# Altium schematic sheet vending-pad-002.SchDoc
size 381 x 350 mm; SheetNumber: 1; SheetTotal: 1
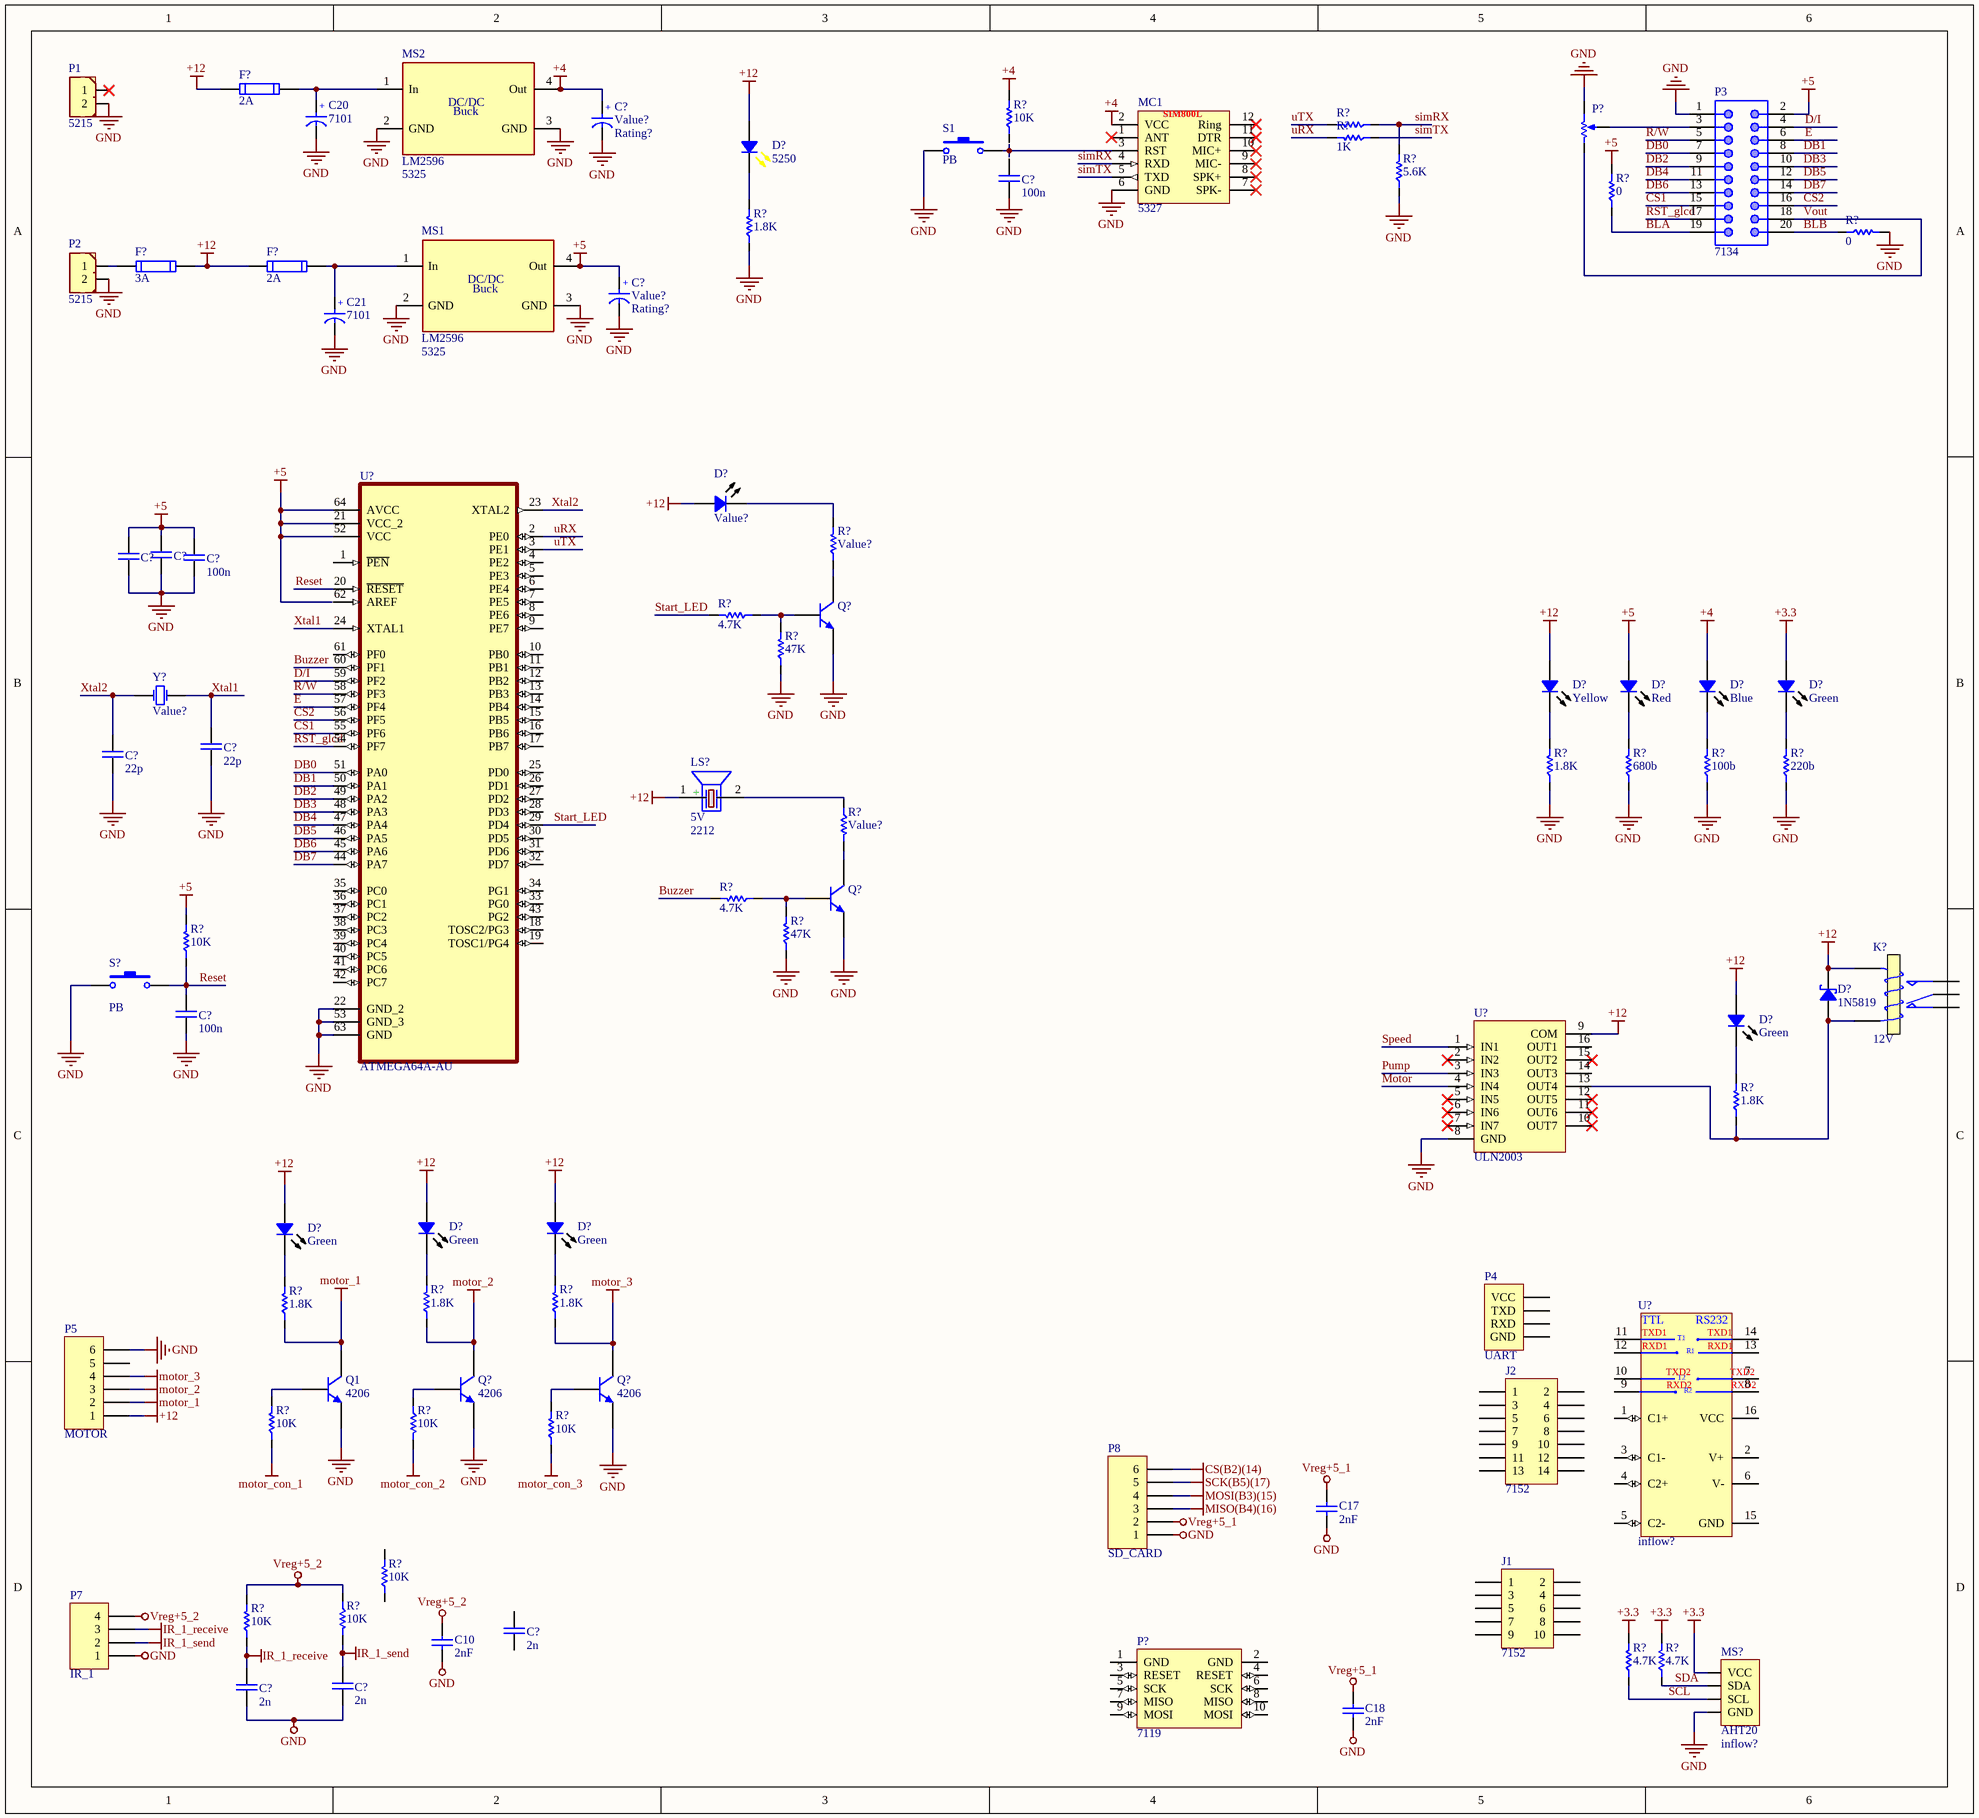
[diagram p0: vending-pad-002.SchDoc]

## Parts
(Parts that share a designator on the sheet are numbered #1, #2 ... from top to bottom, then left to right.)
C10  2nF  [CAP1206]
C17  2nF  [CAP1206]
C18  2nF  [CAP1206]
C20  Inflow: 7101  [Cap electrolitic radial 10x20-5]  (hidden comment: 2200u'F, 16'V)
C21  Inflow: 7101  [Cap electrolitic radial 10x20-5]  (hidden comment: 2200u'F, 16'V)
C?#1  Rating: Rating?  [SMT_C_Tantalum_A]  (hidden comment: Value?)
C?#2  100n  [CAP 1206/3216]
C?#3  Rating: Rating?  [SMT_C_Tantalum_A]  (hidden comment: Value?)
C?#4  (no value)  [CAP 1206/3216]
C?#5  (no value)  [CAP 1206/3216]
C?#6  100n  [CAP 1206/3216]
C?#7  22p  [CAP 1206/3216]
C?#8  22p  [CAP 1206/3216]
C?#9  100n  [CAP 1206/3216]
C?#10  2n  [CAP 1206/3216]
C?#11  2n  [CAP 1206/3216]
C?#12  2n  [CAP 1206/3216]
D?#1  Inflow: 5250  [LED 1206/3216 YELLOW]  (hidden comment: Yellow, 1206)
D?#2  Value?  [LED 1206/3216 GREEN]
D?#3  Yellow  [LED 0805/2012 YELLOW]
D?#4  Red  [LED 0805/2012 RED]
D?#5  Blue  [LED 0805/2012 BLUE]
D?#6  Green  [LED 0805/2012 GREEN]
D?#7  Green  [LED 0805/2012 GREEN]
D?#8  1N5819  [430X270D]
D?#9  Green  [LED 0805/2012 GREEN]
D?#10  Green  [LED 0805/2012 GREEN]
D?#11  Green  [LED 0805/2012 GREEN]
F?#1  2A  [1206_F]
F?#2  3A  [1206_F]
F?#3  2A  [1206_F]
J1  Inflow: 7152  [HDR_THT_5x2M_2.54mm]  (hidden comment: 5x2)
J2  Inflow: 7152  [HDR_THT_7x2M_2.54mm]  (hidden comment: 7x2)
K?  12V  [Relay 18.85x15.35x15.70]
LS?  Inflow: 2212  [BZ_SJ]  (hidden comment: 5V)
MC1  Inflow: 5327  [Sim800L_Module]  (hidden comment: Sim800L)
MS1  Inflow: 5325  [LM2596_modsen]  (hidden comment: LM2596)
MS2  Inflow: 5325  [LM2596_modsen]  (hidden comment: LM2596)
MS?  Inflow: inflow?  [AHT20]  (hidden comment: AHT20)
P1  Inflow: 5215  [645002117322]  (hidden comment: 2'Pin)
P2  Inflow: 5215  [645002117322]  (hidden comment: 2'Pin)
P3  Inflow: 7134  [BOX-HDR-10X2-2.54mm-S]  (hidden comment: 10x2)
P4  UART  [MOLEX KK 0022272041]
P5  MOTOR  [MO-Header 6]
P7  IR_1  [MO-Header 4]
P8  SD_CARD  [MO-Header 6]
P?#1  10K  [Multi turn 01]  (value not drawn)
P?#2  Inflow: 7119  [IDC2.54-10PIN]  (hidden comment: JTAG, 10'Pin)
Q1  Inflow: 4206  [TO-220 AB]  (hidden comment: NPN)
Q?#1  NPN  [SOT23_N]  (value not drawn)
Q?#2  NPN  [SOT23_N]  (value not drawn)
Q?#3  Inflow: 4206  [TO-220 AB]  (hidden comment: NPN)
Q?#4  Inflow: 4206  [TO-220 AB]  (hidden comment: NPN)
R?#1  47K  [RES 1206 (3216X08L)]  (value not drawn)
R?#2  10K  [RES 1206 (3216X08L)]
R?#3  1K  [RES 1206 (3216X08L)]
R?#4  5.6K  [RES 1206 (3216X08L)]
R?#5  0  [RES 1206 (3216X08L)]
R?#6  0  [RES 1206 (3216X08L)]
R?#7  1.8K  [RES 1206 (3216X08L)]
R?#8  Value?  [RES 1206 (3216X08L)]
R?#9  4.7K  [RES 1206 (3216X08L)]
R?#10  47K  [RES 1206 (3216X08L)]
R?#11  1.8K  [RES 0805 (2012X06L)]
R?#12  680b  [RES 0805 (2012X06L)]
R?#13  100b  [RES 0805 (2012X06L)]
R?#14  220b  [RES 0805 (2012X06L)]
R?#15  Value?  [RES 1206 (3216X08L)]
R?#16  4.7K  [RES 1206 (3216X08L)]
R?#17  47K  [RES 1206 (3216X08L)]
R?#18  10K  [RES 1206 (3216X08L)]
R?#19  1.8K  [RES 0805 (2012X06L)]
R?#20  1.8K  [RES 0805 (2012X06L)]
R?#21  1.8K  [RES 0805 (2012X06L)]
R?#22  1.8K  [RES 0805 (2012X06L)]
R?#23  10K  [RES 1206 (3216X08L)]
R?#24  10K  [RES 1206 (3216X08L)]
R?#25  10K  [RES 1206 (3216X08L)]
R?#26  10K  [RES 1206 (3216X08L)]
R?#27  10K  [RES 1206 (3216X08L)]
R?#28  10K  [RES 1206 (3216X08L)]
R?#29  4.7K  [RES 0805 (2012X06L)]
R?#30  4.7K  [RES 0805 (2012X06L)]
S1  PB  [SW_PB_SMD_2PIN_SPST_6X3X2]
S?  PB  [SW_PB_SMD_2PIN_SPST_6X3X2]
U?#1  ATMEGA64A-AU  [QFP80P1600X1600X120-64N]
U?#2  ULN2003  [SO16_M]
U?#3  Inflow: inflow?  [NSO16_M]  (hidden comment: MAX3232)
Y?  Value?  [XTAL Small]

## Nets
+3.3: D?#6.1 MS?.4(VCC) R?#29.2 R?#30.2
+4: C?#1.1(+) D?#5.1 MC1.2(VCC) MS2.4(Out)
+5: C?#3.1(+) C?#4.1 C?#5.1 C?#6.1 D?#4.1 MS1.4(Out) P3.2 R?#5.2 R?#18.2 U?#1.21(VCC_2) U?#1.52(VCC) U?#1.64(AVCC)
+12: D?#1.1 D?#2.1 D?#3.1 D?#7.1 D?#8.2 D?#9.1 D?#10.1 D?#11.1 F?#1.1 F?#2.2 F?#3.1 K?.5(T2) LS?.1(+) P5.1 U?#2.9(COM)
CS(B2)(14): P8.6
GND: C10.2 C17.2 C18.2 C20.2(-) C21.2(-) C?#1.2(-) C?#3.2(-) C?#4.2 C?#5.2 C?#6.2 C?#7.2 C?#8.2 C?#9.2 C?#11.2 C?#12.2 MC1.6(GND) MS1.2(GND) MS1.3(GND) MS2.2(GND) MS2.3(GND) MS?.3(GND) P1.2 P2.2 P3.1 P5.6 P7.1 P8.1 P?#1.1 Q1.3(E) Q?#1.2(E) Q?#2.2(E) Q?#3.3(E) Q?#4.3(E) R?#4.1 R?#6.2 R?#7.1 R?#10.1 R?#11.1 R?#12.1 R?#13.1 R?#14.1 R?#17.1 S1.2 S?.1 U?#1.22(GND_2) U?#1.53(GND_3) U?#1.63(GND) U?#2.8(GND)
IR_1_receive: C?#11.1 P7.3 R?#28.1
IR_1_send: C?#12.1 P7.2 R?#26.2
MISO(B4)(16): P8.3
MOSI(B3)(15): P8.4
motor_1: P5.2 Q1.2(C) R?#20.1
motor_2: P5.3 Q?#3.2(C) R?#21.1
motor_3: P5.4 Q?#4.2(C) R?#22.1
motor_con_1: R?#24.1
motor_con_2: R?#23.2
motor_con_3: R?#25.1
SCK(B5)(17): P8.5
Vreg+5_1: C17.1 C18.1 P8.2
Vreg+5_2: C10.1 P7.4 R?#26.1 R?#28.2
BLA: P3.19 R?#5.1
BLB: P3.20 R?#6.1
Buzzer: R?#16.2 U?#1.60(PF1)
CS1: P3.15 U?#1.55(PF6)
CS2: P3.16 U?#1.56(PF5)
D/I: P3.4 U?#1.59(PF2)
DB0: P3.7 U?#1.51(PA0)
DB1: P3.8 U?#1.50(PA1)
DB2: P3.9 U?#1.49(PA2)
DB3: P3.10 U?#1.48(PA3)
DB4: P3.11 U?#1.47(PA4)
DB5: P3.12 U?#1.46(PA5)
DB6: P3.13 U?#1.45(PA6)
DB7: P3.14 U?#1.44(PA7)
E: P3.6 U?#1.57(PF4)
Motor: U?#2.4(IN4)
Pump: U?#2.3(IN3)
R/W: P3.5 U?#1.58(PF3)
Reset: C?#9.1 R?#18.1 S?.2 U?#1.20(~{RESET})
RST_glcd: P3.17 U?#1.54(PF7)
SCL: MS?.2(SCL) R?#29.1
SDA: MS?.1(SDA) R?#30.1
simRX: MC1.4(RXD) R?#1.1 R?#4.2
simTX: MC1.5(TXD) R?#3.1
Speed: U?#2.1(IN1)
Start_LED: R?#9.2 U?#1.29(PD4)
uRX: R?#3.2 U?#1.2(PE0)
uTX: R?#1.2 U?#1.3(PE1)
Vout: P3.18 P?#1.3
Xtal1: C?#7.1 U?#1.24(XTAL1) Y?.2(OSC2)
Xtal2: C?#8.1 U?#1.23(XTAL2) Y?.1(OSC1)
NetC20_1: C20.1(+) F?#1.2 MS2.1(In)
NetC21_1: C21.1(+) F?#3.2 MS1.1(In)
NetD?#1_2: D?#1.2 R?#7.2
NetD?#2_2: D?#2.2 R?#8.2
NetD?#3_2: D?#3.2 R?#11.2
NetD?#4_2: D?#4.2 R?#12.2
NetD?#5_2: D?#5.2 R?#13.2
NetD?#6_2: D?#6.2 R?#14.2
NetD?#7_2: D?#7.2 R?#19.2
NetD?#8_1: D?#8.1 K?.4(T1) R?#19.1 U?#2.13(OUT4)
NetD?#9_2: D?#9.2 R?#20.2
NetD?#10_2: D?#10.2 R?#21.2
NetD?#11_2: D?#11.2 R?#22.2
NetF?#2_1: F?#2.1 P2.1
NetLS?_2: LS?.2(-) R?#15.1
NetMC1_3: MC1.3(RST) S1.1
NetP3_3: P3.3 P?#1.2
NetQ1_1: Q1.1(B) R?#24.2
NetQ?#1_1: Q?#1.1(B) R?#9.1 R?#10.2
NetQ?#1_3: Q?#1.3(C) R?#8.1
NetQ?#2_1: Q?#2.1(B) R?#16.1 R?#17.2
NetQ?#2_3: Q?#2.3(C) R?#15.2
NetQ?#3_1: Q?#3.1(B) R?#23.1
NetQ?#4_1: Q?#4.1(B) R?#25.2

Not connected (* = marked no-connect by the designer): C?#2 1 2; C?#10 1 2; J1 1 2 3 4 5 6 7 8 9 10; J2 1 2 3 4 5 6 7 8 9 10 11 12 13 14; K? 1(COM) 2(NC) 3(NO); MC1 1(ANT)* 7(SPK-)* 8(SPK+)* 9(MIC-)* 10(MIC+)* 11(DTR)* 12(Ring)*; P1 1*; P4 1(VCC) 2(TXD) 3(RXD) 4(GND); P5 5; P?#2 1(GND) 2(GND) 3(RESET) 4(RESET) 5(SCK) 6(SCK) 7(MISO) 8(MISO) 9(MOSI) 10(MOSI); R?#2 1 2; R?#27 1 2; U?#1 1(~{PEN}) 4(PE2) 5(PE3) 6(PE4) 7(PE5) 8(PE6) 9(PE7) 10(PB0) 11(PB1) 12(PB2) 13(PB3) 14(PB4) 15(PB5) 16(PB6) 17(PB7) 18(TOSC2/PG3) 19(TOSC1/PG4) 25(PD0) 26(PD1) 27(PD2) 28(PD3) 30(PD5) 31(PD6) 32(PD7) 33(PG0) 34(PG1) 35(PC0) 36(PC1) 37(PC2) 38(PC3) 39(PC4) 40(PC5) 41(PC6) 42(PC7) 43(PG2) 61(PF0) 62(AREF); U?#2 2(IN2)* 5(IN5)* 6(IN6)* 7(IN7)* 10(OUT7)* 11(OUT6)* 12(OUT5)* 14(OUT3) 15(OUT2)* 16(OUT1); U?#3 1(C1+) 2(V+) 3(C1-) 4(C2+) 5(C2-) 6(V-) 7(T2OUT) 8(R2IN) 9(R2OUT) 10(T2IN) 11(T1IN) 12(R1OUT) 13(R1IN) 14(T1OUT) 15(GND) 16(VCC)

## Notes on the sheet
- Labels drawn without touching a wire or pin: +4, GND
- (in symbol IC_Converter_MAX3232CSE) TTL; TXD1; T1; RXD1; R1; TXD2; T2; RXD2; R2
- (in symbol ModSen_Com_Sim800L) SIM800L
- (in symbol ModSen_LM2596) DC/DC; Buck

## Library data of the parts
C10 C17 C18 = CAP1206
C20 C21 = Cap_Elec_2200u_16: Electrolit Capacitor; Rating: Rating?; Type: Type?; Validation: NT; Value: 2200u'F, 16'V; Package: Package?
C?#1 C?#3 = Cap_Tantalum: Tantalum Capacitor,TAJ Series-SMD; Inflow: inflow?; Validation: Valid; Package: Package?; Type: Tantalum; Value: Value?
C?#2 C?#4-C?#12 = Cap_Multi_SMD_100nF_1206: Bipolar ceramic capacitor SMD; Type: MultiLayer; Inflow: inflow?; Rating: 50V; Validation: Valid; Package: 1206
  C?#2 C?#6 C?#9: Value: 100n
  C?#7 C?#8: Value: 22p
  C?#10-C?#12: Value: 2n
D?#1 = Semi_LED_Yellow_1206: LED; Rating: Rating?; Type: Type?; Validation: Valid; Value: Yellow, 1206; Package: Package?
D?#2-D?#7 D?#9-D?#11 = Semi_LED_SMD: LED; Inflow: inflow?; Rating: Rating?; Validation: Valid; Package: Package?; Type: LED
  D?#2: Value: Value?
  D?#3: Value: Yellow
  D?#4: Value: Red
  D?#5: Value: Blue
  D?#6 D?#7 D?#9-D?#11: Value: Green
D?#8 = Semi_Diod_Sch_1N5819_SMD: Schottky Rectifiers; Rating: Rating?; Validation: Valid; Inflow: inflow?; Package: SMA; Type: Schottky; Value: 1N5819
F?#1-F?#3 = Other_Elec_Fuse_SMD: Short circiut  protection; Inflow: inflow?; Type: Fast; Rating: Rating?; Validation: Valid; Package: 1206
  F?#1 F?#3: Value: 2A
  F?#2: Value: 3A
J1 = Con_MPH_5x2_V_THT_2.54: Header, dual row, 10 pin; Rating: Rating?; Validation: NT; Value: 5x2; Package: Package?; Type: Type?
J2 = Con_MPH_7x2_V_THT_2.54: Header, dual row, 14 pin; Rating: Rating?; Validation: NT; Value: 7x2; Package: Package?; Type: Type?
K? = SW_Relay_SPDT: SPDT Relay; Rating: Rating?; Validation: Valid; Inflow: inflow?; Type: SPDT; Package: Dip; Value: 12V
LS? = Other_Elec_Buzzer: Magnetic Transducer Buzzer; Rating: 12mm; Validation: Valid; Type: Buzzer; Package: Dip; Value: 5V
MC1 = ModSen_Com_Sim800L: SimCom GSM/GPRS Module; Rating: Rating?; Validation: NT; Value: Sim800L; Package: Dip; Type: GSM-GPRS
MS1 MS2 = ModSen_LM2596: DC to DC Buck converter 1.23V-30V 3A; Rating: Rating?; Validation: Valid; Package: Package?; Type: Type?; Value: LM2596
MS? = ModSen_AHT20: Air Temperature and Humidity Sensor; Rating: Rating?; Validation: NT; Package: Dip; Type: Air T&H; Value: AHT20
P1 P2 = Con_Power_2_PC_H: 2'Pin Power Connector; Rating: Rating?; Validation: Valid; Value: 2'Pin; Package: Package?; Type: Type?
P3 = Con_IDC_10x2: Male Box Header, 20 pins; Rating: Rating?; Validation: NT; Value: 10x2; Package: Package?; Type: Type?
P4 = Con_UART: UART Connector; Rating: Rating?; Validation: Valid; Inflow: 4528; Package: Package?; Type: Type?; Value: UART
P5 P8 = MO-Header 6
P7 = MO-Header 4
P?#1 = Res_Multi: Multi Turn; Rating: Rating?; Validation: Valid; Inflow: inflow?; Package: Package?; Type: Type?; Value: 10K
P?#2 = Con_Prog_USBasp: 10 Pin Standard ISP Header For TNM; Rating: Rating?; Validation: Valid; Value: JTAG, 10'Pin; Package: Package?; Type: Type?
Q1 Q?#3 Q?#4 = Semi_BJT_TIP41C: NPN Power transistor; Rating: Rating?; Type: Type?; Validation: NT; Value: NPN; Package: Package?
Q?#1 Q?#2 = Semi_BJT_BC817: NPN General purpose Transistor; Rating: Rating?; Type: Type?; Validation: Valid; Inflow: inflow?; Value: NPN; Package: Package?
R?#1-R?#10 R?#15-R?#18 R?#23-R?#28 = Res_SMD_1206: Resistor; Inflow: inflow?; Rating: 0.25W; Validation: Valid; Package: 1206; Type: 10%
  R?#1 R?#10 R?#17: Value: 47K
  R?#2 R?#18 R?#23-R?#28: Value: 10K
  R?#3: Value: 1K
  R?#4: Value: 5.6K
  R?#5 R?#6: Value: 0
  R?#7: Value: 1.8K
  R?#8 R?#15: Value: Value?
  R?#9 R?#16: Value: 4.7K
R?#11-R?#14 R?#19-R?#22 R?#29 R?#30 = Res_SMD_0805: Resistor; Inflow: inflow?; Rating: 0.125W; Validation: Valid; Package: 0805; Type: 10%
  R?#11 R?#19-R?#22: Value: 1.8K
  R?#12: Value: 680b
  R?#13: Value: 100b
  R?#14: Value: 220b
  R?#29 R?#30: Value: 4.7K
S1 S? = SW_PushButton_2_SMD: SMT Tactile ‎Switch; Rating: 2b; Validation: Valid; Inflow: 8260; Type: Vertical; Package: SMD; Value: PB
U?#1 = ATMEGA64A-AU: AVR AVRÂ® ATmega Microcontroller IC 8-Bit 16MHz 64KB (32K x 16) FLASH 64-TQFP (14x14); MF: Microchip; SnapEDA_Link: https://www.snapeda.com/parts/ATMEGA64A-AU/Microchip/view-part/?ref=snap; Package: TQFP-64 Microchip; Value: *; MP: ATMEGA64A-AU; Check_prices: https://www.snapeda.com/parts/ATMEGA64A-AU/Microchip/view-part/?ref=eda
U?#2 = IC_Driver_ULN2003: Seven darlington array drivers; Rating: Rating?; Validation: Valid; Inflow: 1506; Package: SO-16; Type: Driver; Value: ULN2003
U?#3 = IC_Converter_MAX3232CSE: RS-232 Interface IC 3.0V to 5.5V, Low-Power, up to 1Mbps, True RS-232 Transceivers Using Four 0.1uF External Capacitors; Rating: Rating?; Validation: Valid; Value: MAX3232; Package: SOIC-16; Type: RS232
Y? = Other_Elec_Xtal_THT: Crystal Oscillator; Rating: Rating?; Inflow: inflow?; Validation: Valid; Type: Quartz; Package: Dip; Value: Value?